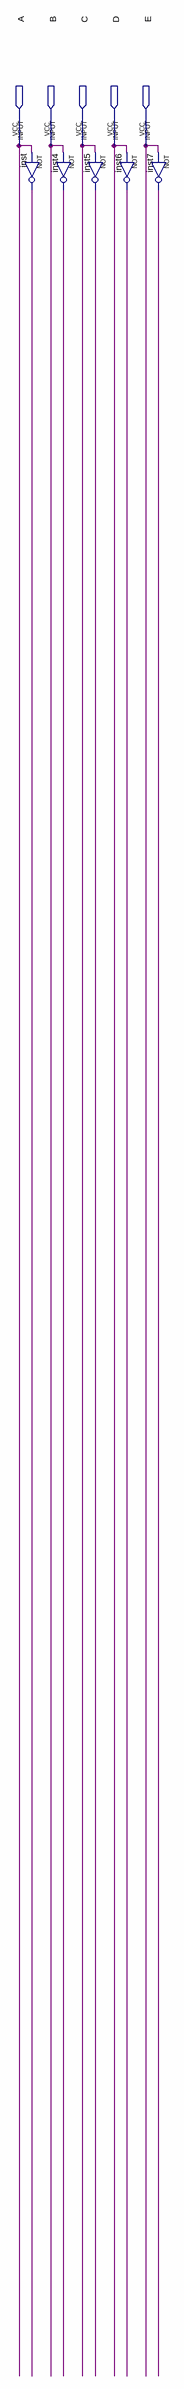
[diagram p0: schematic sheet]
// Quartus schematic barramento_default.bdf as structural Verilog: 5 symbols, 5 pins
module barramento_default (
  input  A,
  input  B,
  input  C,
  input  D,
  input  E
);

  wire inst4_out, inst5_out, inst6_out, inst7_out, inst_out;

  not inst (inst_out, A);
  not inst4 (inst4_out, B);
  not inst5 (inst5_out, C);
  not inst6 (inst6_out, D);
  not inst7 (inst7_out, E);
endmodule
